# EAGLE design sensorboard_18_DS2_dD2b (EAGLE 9.6.0)
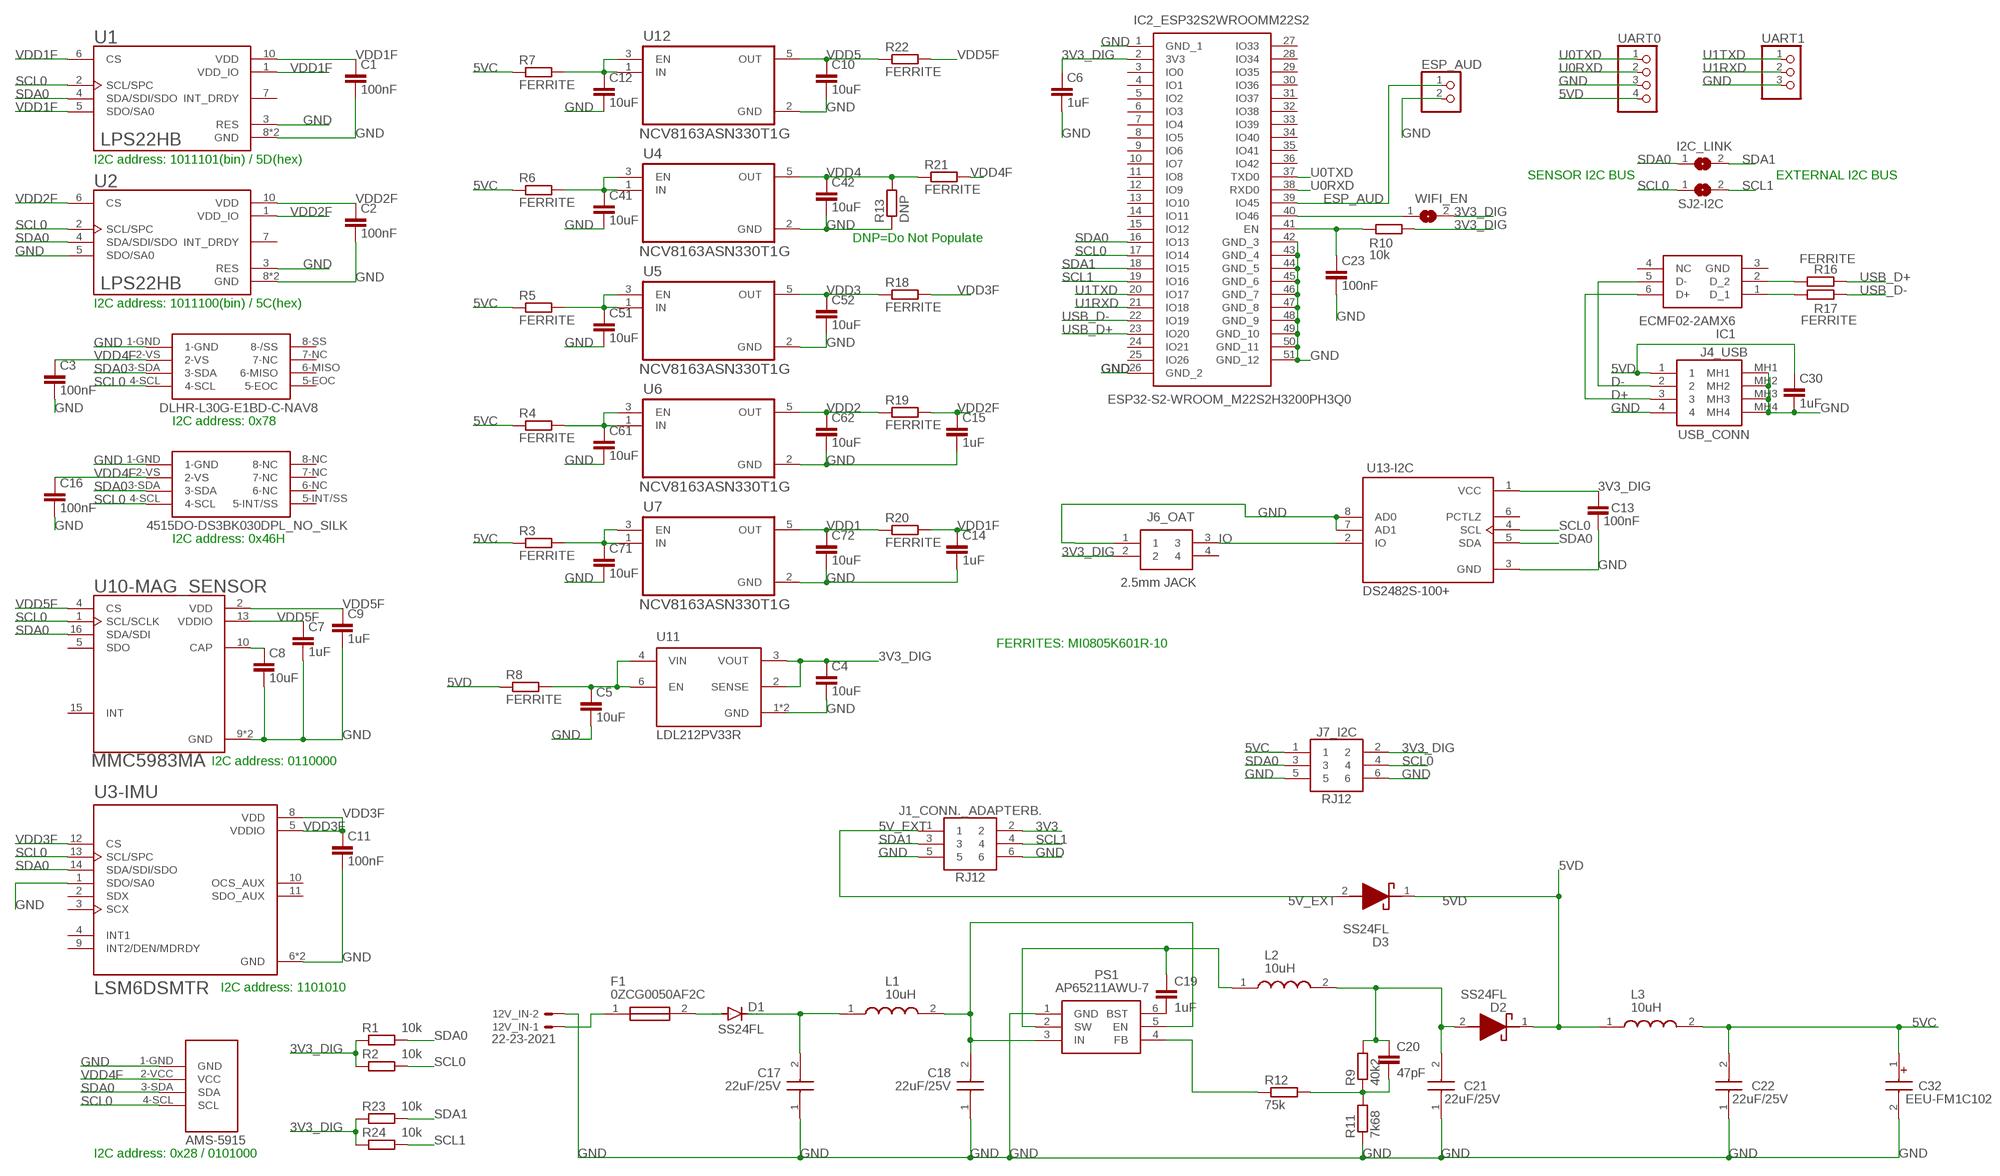
[diagram p0: schematic, sheet 1]

## Parts
12V_IN  22-23-2021  [22-23-2021]
C1  100nF  C-EUC0603  [C0603]
C2  100nF  C-EUC0603  [C0603]
C3  100nF  C-EUC0805  [C0805]
C4  10uF  C-EUC0805  [C0805]
C5  10uF  C-EUC0805  [C0805]
C6  1uF  C-EUC0805  [C0805]
C7  1uF  C-EUC0805  [C0805]
C8  10uF  C-EUC0805  [C0805]
C9  1uF  C-EUC0805  [C0805]
C10  10uF  C-EUC0805  [C0805]
C11  100nF  C-EUC0805  [C0805]
C12  10uF  C-EUC0805  [C0805]
C13  100nF  C-EUC0805  [C0805]
C14  1uF  C-EUC0805  [C0805]
C15  1uF  C-EUC0805  [C0805]
C16  100nF  C-EUC0805  [C0805]
C17  22uF/25V  CL31A226KAHNNNE  [CAPC3216X180N]
C18  22uF/25V  CL31A226KAHNNNE  [CAPC3216X180N]
C19  1uF  C-EUC0805  [C0805]
C20  47pF  C-EUC0805  [C0805]
C21  22uF/25V  CL31A226KAHNNNE  [CAPC3216X180N]
C22  22uF/25V  CL31A226KAHNNNE  [CAPC3216X180N]
C23  100nF  C-EUC0805  [C0805]
C30  1uF  C-EUC0805  [C0805]
C32  EEU-FM1C102  [CAPPRD500W65D1000H2200]
C41  10uF  C-EUC0805  [C0805]
C42  10uF  C-EUC0805  [C0805]
C51  10uF  C-EUC0805  [C0805]
C52  10uF  C-EUC0805  [C0805]
C61  10uF  C-EUC0805  [C0805]
C62  10uF  C-EUC0805  [C0805]
C71  10uF  C-EUC0805  [C0805]
C72  10uF  C-EUC0805  [C0805]
D1  SS24FL  DIODE-DO-214AC  [DO-214AC]
D2  SS24FL  [SODFL3617X108N]
D3  SS24FL  [SODFL3617X108N]
ESP_AUD  PINHD-1X2  [1X02]
F1  0ZCG0050AF2C  [FUSC4632X75N]
I2C_LINK  SJ  [SJ]
IC1  ECMF02-2AMX6  [SON50P150X170X55-6N]
IC2_ESP32S2WROOMM22S2  ESP32-S2-WROOM_M22S2H3200PH3Q0  [ESP32S2WROOMM22S2H3200PH3Q0]
J1_CONN._ADAPTERB.  RJ12  SAMACSYS_615006138421"  [SAMACSYS_615006138421_MOD]
J4_USB  USB_CONN  73725-0110BLF  [737250110BLF]
J6_OAT  2.5mm JACK  SJ-2523-SMT-TR  [SJ-2523-SMT-TR]
J7_I2C  RJ12  SAMACSYS_615006138421"  [SAMACSYS_615006138421_MOD]
L1  10uH  FDSD0420-H-100M=P3  [FDSD0420WH150MP3]
L2  10uH  FDSD0420-H-100M=P3  [FDSD0420WH150MP3]
L3  10uH  FDSD0420-H-100M=P3  [FDSD0420WH150MP3]
PS1  AP65211AWU-7  [SOT95P280X90-6N]
R1  10k  R-EU_R0805  [R0805]
R2  10k  R-EU_R0805  [R0805]
R3  FERRITE  R-EU_R0805  [R0805]
R4  FERRITE  R-EU_R0805  [R0805]
R5  FERRITE  R-EU_R0805  [R0805]
R6  FERRITE  R-EU_R0805  [R0805]
R7  FERRITE  R-EU_R0805  [R0805]
R8  FERRITE  R-EU_R0805  [R0805]
R9  40k2  R-EU_R0805  [R0805]
R10  10k  R-EU_R0805  [R0805]
R11  7k68  R-EU_R0805  [R0805]
R12  75k  R-EU_R0805  [R0805]
R13  DNP  R-EU_R0805  [R0805]
R16  FERRITE  R-EU_R0805  [R0805]
R17  FERRITE  R-EU_R0805  [R0805]
R18  FERRITE  R-EU_R0805  [R0805]
R19  FERRITE  R-EU_R0805  [R0805]
R20  FERRITE  R-EU_R0805  [R0805]
R21  FERRITE  R-EU_R0805  [R0805]
R22  FERRITE  R-EU_R0805  [R0805]
R23  10k  R-EU_R0805  [R0805]
R24  10k  R-EU_R0805  [R0805]
SJ2-I2C  SJ  [SJ]
U1  LPS22HB  [LGA10R50P2X3_200X200X80]
U2  LPS22HB  [LGA10R50P2X3_200X200X80]
U3-IMU  LSM6DSMTR  [PQFN50P300X250X86-14N]
U4  NCV8163ASN330T1G  [SOP95P275X110-5N]
U5  NCV8163ASN330T1G  [SOP95P275X110-5N]
U6  NCV8163ASN330T1G  [SOP95P275X110-5N]
U7  NCV8163ASN330T1G  [SOP95P275X110-5N]
U10-MAG_SENSOR  MMC5983MA  [LGA16R50P4X4_330X330X100]
U11  LDL212PV33R  [SON50P200X200X80-7N]
U12  NCV8163ASN330T1G  [SOP95P275X110-5N]
U13-I2C  DS2482S-100+  [SOIC127P600X175-8N]
U$1  AMS-5915  [AMS-5915]
U$3  DLHR-L30G-E1BD-C-NAV8  [DLHR-L30G-E1BD-C-NAV8]
U$4  4515DO-DS3BK030DPL  4515DO-DS3BK030DPL_NO_SILKNO_SILK  [4515DO-DS3BK030DPL_NO_SILK]
UART0  PINHD-1X4  [1X04]
UART1  PINHD-1X3  [1X03]
WIFI_EN  SJ  [SJ]

## Nets
3V3: J1_CONN._ADAPTERB..2
3V3_DIG: C4.1 C6.1 C13.1 IC2_ESP32S2WROOMM22S2.2(3V3) J6_OAT.2 J7_I2C.2 R1.1 R2.1 R10.2 R23.1 R24.1 U11.2(SENSE) U11.3(VOUT) U13-I2C.1(VCC) WIFI_EN.2
5V_EXT: D3.2(A) J1_CONN._ADAPTERB..1
5VC: C22.2 C32.1(+) J7_I2C.1 L3.2 R3.1 R4.1 R5.1 R6.1 R7.1
5VD: C30.1 D2.1(K) D3.1(K) J4_USB.1 L3.1 R8.1 UART0.4
D+: IC1.6(D+) J4_USB.3
D-: IC1.5(D-) J4_USB.2
ESP_AUD: ESP_AUD.1 IC2_ESP32S2WROOMM22S2.39(IO45)
GND: 12V_IN.2 C1.2 C2.2 C3.2 C4.2 C5.2 C6.2 C7.2 C8.2 C9.2 C10.2 C11.2 C12.2 C13.2 C14.2 C15.2 C16.2 C17.1 C18.1 C21.1 C22.1 C23.2 C30.2 C32.2(-) C41.2 C42.2 C51.2 C52.2 C61.2 C62.2 C71.2 C72.2 ESP_AUD.2 IC2_ESP32S2WROOMM22S2.1(GND_1) IC2_ESP32S2WROOMM22S2.26(GND_2) IC2_ESP32S2WROOMM22S2.42(GND_3) IC2_ESP32S2WROOMM22S2.43(GND_4) IC2_ESP32S2WROOMM22S2.44(GND_5) IC2_ESP32S2WROOMM22S2.45(GND_6) IC2_ESP32S2WROOMM22S2.46(GND_7) IC2_ESP32S2WROOMM22S2.47(GND_8) IC2_ESP32S2WROOMM22S2.48(GND_9) IC2_ESP32S2WROOMM22S2.49(GND_10) IC2_ESP32S2WROOMM22S2.50(GND_11) IC2_ESP32S2WROOMM22S2.51(GND_12) J1_CONN._ADAPTERB..5 J1_CONN._ADAPTERB..6 J4_USB.4 J4_USB.MH1 J4_USB.MH2 J4_USB.MH3 J4_USB.MH4 J6_OAT.1 J7_I2C.5 J7_I2C.6 PS1.1(GND) R11.1 R13.1 U1.3(RES) U1.8(GND) U1.9(GND) U2.3(RES) U2.5(SDO/SA0) U2.8(GND) U2.9(GND) U3-IMU.1(SDO/SA0) U3-IMU.6(GND) U3-IMU.7(GND) U4.2(GND) U5.2(GND) U6.2(GND) U7.2(GND) U10-MAG_SENSOR.9(GND) U10-MAG_SENSOR.11(GND) U11.1(GND) U11.7(GND) U12.2(GND) U13-I2C.3(GND) U13-I2C.7(AD1) U13-I2C.8(AD0) U$1.1-GND(GND) U$3.1-GND U$4.1-GND UART0.3 UART1.3
IO: J6_OAT.3 U13-I2C.2(IO)
N$2: C8.1 U10-MAG_SENSOR.10(CAP)
N$7: C23.1 IC2_ESP32S2WROOMM22S2.41(EN) R10.1
N$9: C17.2 D1.C L1.1
N$13: C18.2 L1.2 PS1.3(IN) PS1.5(EN)
N$16: C20.2 R9.1 R11.2 R12.2
N$17: C19.1 L2.1 PS1.2(SW)
N$18: PS1.4(FB) R12.1
N$20: C19.2 PS1.6(BST)
N$24: 12V_IN.1 F1.1
N$25: IC2_ESP32S2WROOMM22S2.40(IO46) WIFI_EN.1
N$27: IC1.1(D_1) R17.1
N$28: IC1.2(D_2) R16.1
N$32: D1.A F1.2
N$33: C20.1 C21.2 D2.2(A) L2.2 R9.2
SCL0: IC2_ESP32S2WROOMM22S2.17(IO14) J7_I2C.4 R2.2 SJ2-I2C.1 U1.2(SCL/SPC) U2.2(SCL/SPC) U3-IMU.13(SCL/SPC) U10-MAG_SENSOR.1(SCL/SCLK) U13-I2C.4(SCL) U$1.4-SCL(SCL) U$3.4-SCL U$4.4-SCL
SCL1: IC2_ESP32S2WROOMM22S2.19(IO16) J1_CONN._ADAPTERB..4 R24.2 SJ2-I2C.2
SDA0: I2C_LINK.1 IC2_ESP32S2WROOMM22S2.16(IO13) J7_I2C.3 R1.2 U1.4(SDA/SDI/SDO) U2.4(SDA/SDI/SDO) U3-IMU.14(SDA/SDI/SDO) U10-MAG_SENSOR.16(SDA/SDI) U13-I2C.5(SDA) U$1.3-SDA(SDA) U$3.3-SDA U$4.3-SDA
SDA1: I2C_LINK.2 IC2_ESP32S2WROOMM22S2.18(IO15) J1_CONN._ADAPTERB..3 R23.2
U0RXD: IC2_ESP32S2WROOMM22S2.38(RXD0) UART0.2
U0TXD: IC2_ESP32S2WROOMM22S2.37(TXD0) UART0.1
U1RXD: IC2_ESP32S2WROOMM22S2.21(IO18) UART1.2
U1TXD: IC2_ESP32S2WROOMM22S2.20(IO17) UART1.1
USB_D+: IC2_ESP32S2WROOMM22S2.23(IO20) R16.2
USB_D-: IC2_ESP32S2WROOMM22S2.22(IO19) R17.2
VDD1: C72.1 R20.1 U7.5(OUT)
VDD1F: C1.1 C14.1 R20.2 U1.1(VDD_IO) U1.5(SDO/SA0) U1.6(CS) U1.10(VDD)
VDD1P: C71.1 R3.2 U7.1(IN) U7.3(EN)
VDD2: C62.1 R19.1 U6.5(OUT)
VDD2F: C2.1 C15.1 R19.2 U2.1(VDD_IO) U2.6(CS) U2.10(VDD)
VDD2P: C61.1 R4.2 U6.1(IN) U6.3(EN)
VDD3: C52.1 R18.1 U5.5(OUT)
VDD3F: C11.1 R18.2 U3-IMU.5(VDDIO) U3-IMU.8(VDD) U3-IMU.12(CS)
VDD3P: C51.1 R5.2 U5.1(IN) U5.3(EN)
VDD4: C42.1 R13.2 R21.1 U4.5(OUT)
VDD4F: C3.1 C16.1 R21.2 U$1.2-VCC(VCC) U$3.2-VS U$4.2-VS
VDD4P: C41.1 R6.2 U4.1(IN) U4.3(EN)
VDD5: C10.1 R22.1 U12.5(OUT)
VDD5F: C7.1 C9.1 R22.2 U10-MAG_SENSOR.2(VDD) U10-MAG_SENSOR.4(CS) U10-MAG_SENSOR.13(VDDIO)
VDD5P: C12.1 R7.2 U12.1(IN) U12.3(EN)
VDD_DIGP: C5.1 R8.2 U11.4(VIN) U11.6(EN)
Unconnected: IC1.4(NC) IC2_ESP32S2WROOMM22S2.3(IO0) IC2_ESP32S2WROOMM22S2.4(IO1) IC2_ESP32S2WROOMM22S2.5(IO2) IC2_ESP32S2WROOMM22S2.6(IO3) IC2_ESP32S2WROOMM22S2.7(IO4) IC2_ESP32S2WROOMM22S2.8(IO5) IC2_ESP32S2WROOMM22S2.9(IO6) IC2_ESP32S2WROOMM22S2.10(IO7) IC2_ESP32S2WROOMM22S2.11(IO8) IC2_ESP32S2WROOMM22S2.12(IO9) IC2_ESP32S2WROOMM22S2.13(IO10) IC2_ESP32S2WROOMM22S2.14(IO11) IC2_ESP32S2WROOMM22S2.15(IO12) IC2_ESP32S2WROOMM22S2.24(IO21) IC2_ESP32S2WROOMM22S2.25(IO26) IC2_ESP32S2WROOMM22S2.27(IO33) IC2_ESP32S2WROOMM22S2.28(IO34) IC2_ESP32S2WROOMM22S2.29(IO35) IC2_ESP32S2WROOMM22S2.30(IO36) IC2_ESP32S2WROOMM22S2.31(IO37) IC2_ESP32S2WROOMM22S2.32(IO38) IC2_ESP32S2WROOMM22S2.33(IO39) IC2_ESP32S2WROOMM22S2.34(IO40) IC2_ESP32S2WROOMM22S2.35(IO41) IC2_ESP32S2WROOMM22S2.36(IO42) J6_OAT.4 U1.7(INT_DRDY) U2.7(INT_DRDY) U3-IMU.2(SDX) U3-IMU.3(SCX) U3-IMU.4(INT1) U3-IMU.9(INT2/DEN/MDRDY) U3-IMU.10(OCS_AUX) U3-IMU.11(SDO_AUX) U10-MAG_SENSOR.5(SDO) U10-MAG_SENSOR.15(INT) U13-I2C.6(PCTLZ) U$3.5-EOC U$3.6-MISO U$3.7-NC U$3.8-SS(8-/SS) U$4.5-INT/SS U$4.6-NC U$4.7-NC U$4.8-NC

## Notes on the sheet
- I2C address: 1011101(bin) / 5D(hex)
- SENSOR I2C BUS | EXTERNAL I2C BUS
- DNP=Do Not Populate
- I2C address: 1011100(bin) / 5C(hex)
- I2C address: 0x78
- I2C address: 0x46H
- FERRITES: MI0805K601R-10
- I2C address: 0110000
- I2C address: 1101010
- I2C address: 0x28 / 0101000

## Power pins joined to a net without a drawn wire
GND: IC1.3(GND)

## Library data of the parts
12V_IN = con-molex:22-23-2021: .100" (2.54mm) Center Header - 2 Pin; MF: MOLEX; MPN: 22-23-2021; OC_FARNELL: 1462926; OC_NEWARK: 25C3832
C1-C16 C19 C20 C23 C30 C41 C42 C51 C52 C61 C62 C71 C72 = rcl:C-EU: CAPACITOR, European symbol; SPICEPREFIX: C
C17 C18 C21 C22 = SamacSys_Parts:CL31A226KAHNNNE: SAMSUNG ELECTRO-MECHANICS - CL31A226KAHNNNE - CAP, 22UF, 25V, MLCC, 1206 Source: Datasheet <http://www.samsungsem.com/kr/support/product-search/mlcc/CL31A226KAHNNNE.jsp>; DESCRIPTION: SAMSUNG ELECTRO-MECHANICS - CL31A226KAHNNNE - CAP, 22UF, 25V, MLCC, 1206; HEIGHT: 1.8mm; MANUFACTURER_NAME: Samsung Electro-Mechanics; MANUFACTURER_PART_NUMBER: CL31A226KAHNNNE; MOUSER_PART_NUMBER: N/A; MOUSER_PRICE-STOCK: https://www.mouser.com/Search/Refine.aspx?Keyword=N%2FA
C32 = SamacSys_Parts:EEU-FM1C102: Al Electrolytic Cap 105C 16V 1000uF Panasonic 1000uF 16 V dc Aluminium Electrolytic Capacitor, FM Series 5000h 10 Dia. x 20mm Source: Datasheet <http://industrial.panasonic.com/cdbs/www-data/pdf/RDF0000/ABA0000C1018.pdf>; DESCRIPTION: Al Electrolytic Cap 105C 16V 1000uF Panasonic 1000uF 16 V dc Aluminium Electrolytic Capacitor, FM Series 5000h 10 Dia. x 20mm; HEIGHT: 22mm; MANUFACTURER_NAME: Panasonic; MANUFACTURER_PART_NUMBER: EEU-FM1C102; MOUSER_PART_NUMBER: 667-EEU-FM1C102; MOUSER_PRICE-STOCK: https://www.mouser.co.uk/ProductDetail/Panasonic/EEU-FM1C102?qs=MtOUKumLmnZ3b%252BuCdcXLJA%3D%3D
D1 = diode:DIODE-: DIODE
D2 D3 = SamacSys_Parts:SS24FL: ON SEMICONDUCTOR - SS24FL - SCHOTTKY RECT, AEC-Q101, 40V, SOD-123F Source: Datasheet <https://www.onsemi.com/pub/Collateral/SS26FL-D.PDF>; DESCRIPTION: ON SEMICONDUCTOR - SS24FL - SCHOTTKY RECT, AEC-Q101, 40V, SOD-123F; HEIGHT: 1.08mm; MANUFACTURER_NAME: ON Semiconductor; MANUFACTURER_PART_NUMBER: SS24FL; MOUSER_PART_NUMBER: 512-SS24FL; MOUSER_PRICE-STOCK: https://www.mouser.co.uk/ProductDetail/ON-Semiconductor-Fairchild/SS24FL?qs=tqW9UTzndZyvT5hdH%252BfSxg%3D%3D
ESP_AUD = pinhead:PINHD-1X2: PIN HEADER
F1 = SamacSys_Parts:0ZCG0050AF2C: Resettable Fuses - PPTC Fuse Source: Datasheet <http://belfuse.com/pdfs/0ZCG.pdf>; DESCRIPTION: Resettable Fuses - PPTC Fuse; HEIGHT: 0.75mm; MANUFACTURER_NAME: Stewart Connector; MANUFACTURER_PART_NUMBER: 0ZCG0050AF2C; MOUSER_PART_NUMBER: 530-0ZCG0050AF2C; MOUSER_PRICE-STOCK: https://www.mouser.co.uk/ProductDetail/Bel-Fuse/0ZCG0050AF2C?qs=SRYZG9HaIQ0mNZjboPT99Q%3D%3D
I2C_LINK SJ2-I2C WIFI_EN = jumper:SJ: SMD solder JUMPER
IC1 = ECMF02-2AMX6:ECMF02-2AMX6: Common Mode Filter & ESD Prot. USB uQFN6 STMicroelectronics ECMF02 Series, Signal Filter, 200mA uQFN SMD, Flat Contact Termination, 1.8 x 1.6 x 0.5mm Source: Datasheet <http://www.st.com/content/ccc/resource/technical/document/datasheet/3a/28/cf/d0/31/63/48/8c/CD00282307.pdf/files/CD00282307.pdf/jcr:content/translations/en.CD00282307.pdf> Check prices <https://pricing.snapeda.com/parts/ECMF02-2AMX6/STMicroelectronics/view-part?ref=eda>; AVAILABILITY: Good; DESCRIPTION: 2 Line Common Mode Choke Surface Mount 200mA DCR 2.5Ohm; MF: STMicroelectronics; MP: ECMF02-2AMX6; PACKAGE: UFQFN-6 STMicroelectronics; PRICE: None; PURCHASE-URL: https://pricing.snapeda.com/search/part/ECMF02-2AMX6/?ref=eda
IC2_ESP32S2WROOMM22S2 = SamacSys_Parts:ESP32-S2-WROOM_M22S2H3200PH3Q0: WiFi Modules (802.11) Module ESP32-S2 WROOM PCB ANT Source: Datasheet; DESCRIPTION: WiFi Modules (802.11) Module ESP32-S2 WROOM PCB ANT; HEIGHT: 3.45mm; MANUFACTURER_NAME: Espressif Systems; MANUFACTURER_PART_NUMBER: ESP32-S2-WROOM(M22S2H3200PH3Q0); MOUSER_PART_NUMBER: 356-ESP32S2WRM3200PH; MOUSER_PRICE-STOCK: https://www.mouser.co.uk/ProductDetail/Espressif-Systems/ESP32-S2-WROOMM22S2H3200PH3Q0?qs=vHuUswq2%252BsxRlbezmiT%252B3g%3D%3D
J1_CONN._ADAPTERB. J7_I2C = Sensor_Board_DS2:SAMACSYS_615006138421: HORIZONTAL PLASTIC 6P6C MODULAR JACK TAP UP Source: Datasheet <http://docs-emea.rs-online.com/webdocs/0f88/0900766b80f88670.pdf>
J4_USB = SamacSys_Parts:73725-0110BLF: USB Connectors USB UP RIGHT RECEP W/O SENSOR FLAG Source: Datasheet; DESCRIPTION: USB Connectors USB UP RIGHT RECEP W/O SENSOR FLAG; HEIGHT: 14.03mm; MANUFACTURER_NAME: Amphenol; MANUFACTURER_PART_NUMBER: 73725-0110BLF; MOUSER_PART_NUMBER: 649-73725-0110BLF; MOUSER_PRICE-STOCK: https://www.mouser.co.uk/ProductDetail/Amphenol-FCI/73725-0110BLF?qs=x6EjVpvqMVP%252BaDTVID3rTA%3D%3D
J6_OAT = SamacSys_Parts:SJ-2523-SMT-TR: 2.5 MM AUDIO JACK Source: Datasheet <http://www.cui.com/product/resource/digikeypdf/sj-252x-smt_series.pdf>; ARROW_PART_NUMBER: SJ-2523-SMT-TR; ARROW_PRICE-STOCK: https://www.arrow.com/en/products/sj-2523-smt-tr/cui-devices; DESCRIPTION: 2.5 MM AUDIO JACK; HEIGHT: mm; MANUFACTURER_NAME: CUI Inc.; MANUFACTURER_PART_NUMBER: SJ-2523-SMT-TR; MOUSER_PART_NUMBER: 490-SJ-2523-SMT-TR; MOUSER_PRICE-STOCK: https://www.mouser.co.uk/ProductDetail/CUI-Devices/SJ-2523-SMT-TR/?qs=WyjlAZoYn50TRxpi%2FhdHvw%3D%3D
L1-L3 = SamacSys_Parts:FDSD0420-H-100M=P3: Toko FDSD0420 Series Shielded Wire-wound SMD Inductor with a Powered Iron Core, 10 uH Wire-Wound 3.3A Idc Source: Datasheet <https://psearch.en.murata.com/inductor/product/FDSD0420-H-100M#.html>; DESCRIPTION: Toko FDSD0420 Series Shielded Wire-wound SMD Inductor with a Powered Iron Core, 10 uH Wire-Wound 3.3A Idc; HEIGHT: 2mm; MANUFACTURER_NAME: Murata Electronics; MANUFACTURER_PART_NUMBER: FDSD0420-H-100M=P3; MOUSER_PART_NUMBER: 81-FDSD0420-H-100MP3; MOUSER_PRICE-STOCK: https://www.mouser.co.uk/ProductDetail/Murata-Electronics/FDSD0420-H-100M%3dP3?qs=KuGPmAKtFKXZ0m3Q9jeEIg%3D%3D
PS1 = SamacSys_Parts:AP65211AWU-7: Switching Voltage Regulators DCDC Conv HV Buck Source: Datasheet <https://componentsearchengine.com/Datasheets/1/AP65211AWU-7.pdf>; DESCRIPTION: Switching Voltage Regulators DCDC Conv HV Buck; HEIGHT: 0.9mm; MANUFACTURER_NAME: Diodes Inc.; MANUFACTURER_PART_NUMBER: AP65211AWU-7; MOUSER_PART_NUMBER: 621-AP65211AWU-7; MOUSER_PRICE-STOCK: https://www.mouser.co.uk/ProductDetail/Diodes-Incorporated/AP65211AWU-7?qs=HXFqYaX1Q2yDqQLsq3DZAg%3D%3D
R1-R13 R16-R24 = rcl:R-EU_: RESISTOR, European symbol; SPICEPREFIX: R
U1 U2 = LPS22HB:LPS22HB: MEMS nano pressure sensor: 260-1260 hPa absolute digital output barometer; AVAILABILITY: Unavailable; DESCRIPTION: Pressure Sensor 3.77PSI ~ 18.27PSI (26kPa ~ 126kPa) Absolute 24 b 10-WFLGA Exposed Pad; MF: STMicroelectronics; MP: LPS22HB; PACKAGE: WFLGA-10 STMicroelectronics; PRICE: None
U3-IMU = LSM6DSMTR:LSM6DSMTR: iNEMO inertial module: 3D accelerometer and 3D gyroscope Check prices <https://snapeda.com/parts/LSM6DSMTR/STMicroelectronics/view-part/?ref=eda>; ARROW_ELECTRONICS-PURCHASE-URL: https://snapeda.com/shop?store=Arrow+Electronics&id=581716; AVAILABILITY: Good; DESCRIPTION: Accelerometer, Gyroscope, Temperature, 6 Axis Sensor I²C, SPI Output; DIGIKEY-PURCHASE-URL: https://snapeda.com/shop?store=DigiKey&id=581716; MF: STMicroelectronics; MOUSER-PURCHASE-URL: https://snapeda.com/shop?store=Mouser&id=581716; MP: LSM6DSMTR; PACKAGE: VFLGA-14 STMicroelectronics; PRICE: None
U4-U7 U12 = NCV8163ASN330T1G:NCV8163ASN330T1G: None Check prices <https://snapeda.com/parts/NCV8163ASN330T1G/ON%20Semiconductor/view-part/?ref=eda>; AVAILABILITY: Warning; DESCRIPTION: Linear Voltage Regulator IC 1 Output 250mA 5-TSOP; MF: ON Semiconductor; MOUSER-PURCHASE-URL: https://snapeda.com/shop?store=Mouser&id=3218317; MP: NCV8163ASN330T1G; PACKAGE: TSOP-5 ON Semiconductor; PRICE: None
U10-MAG_SENSOR = FIS1100:MMC5983MA: MMC5983MA Magnetometer; ARROW_ELECTRONICS-PURCHASE-URL: https://snapeda.com/shop?store=Arrow+Electronics&id=1392125; AVAILABILITY: Good; DESCRIPTION: Accelerometer, Gyroscope, 6 Axis Sensor I²C Output; DIGIKEY-PURCHASE-URL: https://snapeda.com/shop?store=DigiKey&id=1392125; MF: ON Semiconductor; MP: FIS1100; PACKAGE: VFLGA-16 ON Semiconductor; PRICE: None
U11 = LDL212PV33R:LDL212PV33R: Linear Voltage Regulator IC 1 Output 1.2A 6-DFN (2x2) Check prices <https://snapeda.com/parts/LDL212PV33R/STMicroelectronics/view-part/?ref=eda>; ARROW_ELECTRONICS-PURCHASE-URL: https://snapeda.com/shop?store=Arrow+Electronics&id=4551149; AVAILABILITY: Good; DESCRIPTION: Linear Voltage Regulator IC 1 Output 1.2A 6-DFN (2x2); DIGIKEY-PURCHASE-URL: https://snapeda.com/shop?store=DigiKey&id=4551149; MF: STMicroelectronics; MOUSER-PURCHASE-URL: https://snapeda.com/shop?store=Mouser&id=4551149; MP: LDL212PV33R; PACKAGE: DFN-6 STMicroelectronics; PRICE: None
U13-I2C = DS2482S-100_:DS2482S-100+: DS2460S Series 5.5 V 400 kHz I2C Surface Mount Smart Card Interface IC - SOIC-8 Check prices <https://snapeda.com/parts/DS2482S-100%2B/Maxim%20Integrated/view-part/?ref=eda>; AVAILABILITY: Warning; DESCRIPTION: 1-Wire® Bridge, 1-Wire® to I²C I²C Interface 8-SOIC; DIGIKEY-PURCHASE-URL: https://snapeda.com/shop?store=DigiKey&id=587620; MF: Maxim Integrated; MOUSER-PURCHASE-URL: https://snapeda.com/shop?store=Mouser&id=587620; MP: DS2482S-100+; PACKAGE: SOIC-8 Maxim; PRICE: None
U$1 = pressure_01:AMS-5915
U$3 = pressure_01:DLHR-L30G-E1BD-C-NAV8; DLHR-L30G-E1BD-C-NAV8: DLHR-L30G-E1BD-C-NAV8
U$4 = pressure_01:4515DO-DS3BK030DPL_NO_SILK
UART0 = pinhead:PINHD-1X4: PIN HEADER
UART1 = pinhead:PINHD-1X3: PIN HEADER

## Net classes
0 default: clearance 0.205 mm

## Board
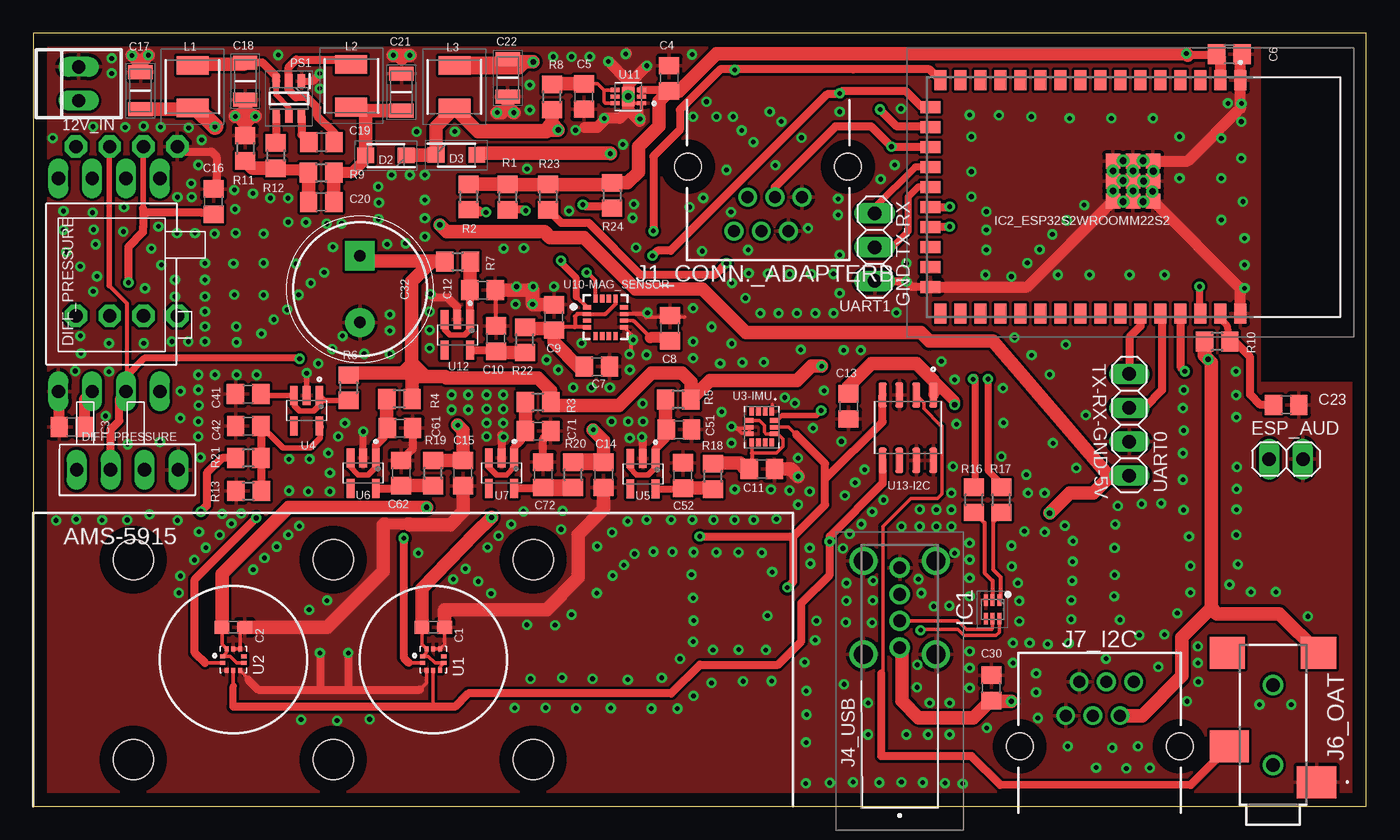
[diagram p1: board, top side]
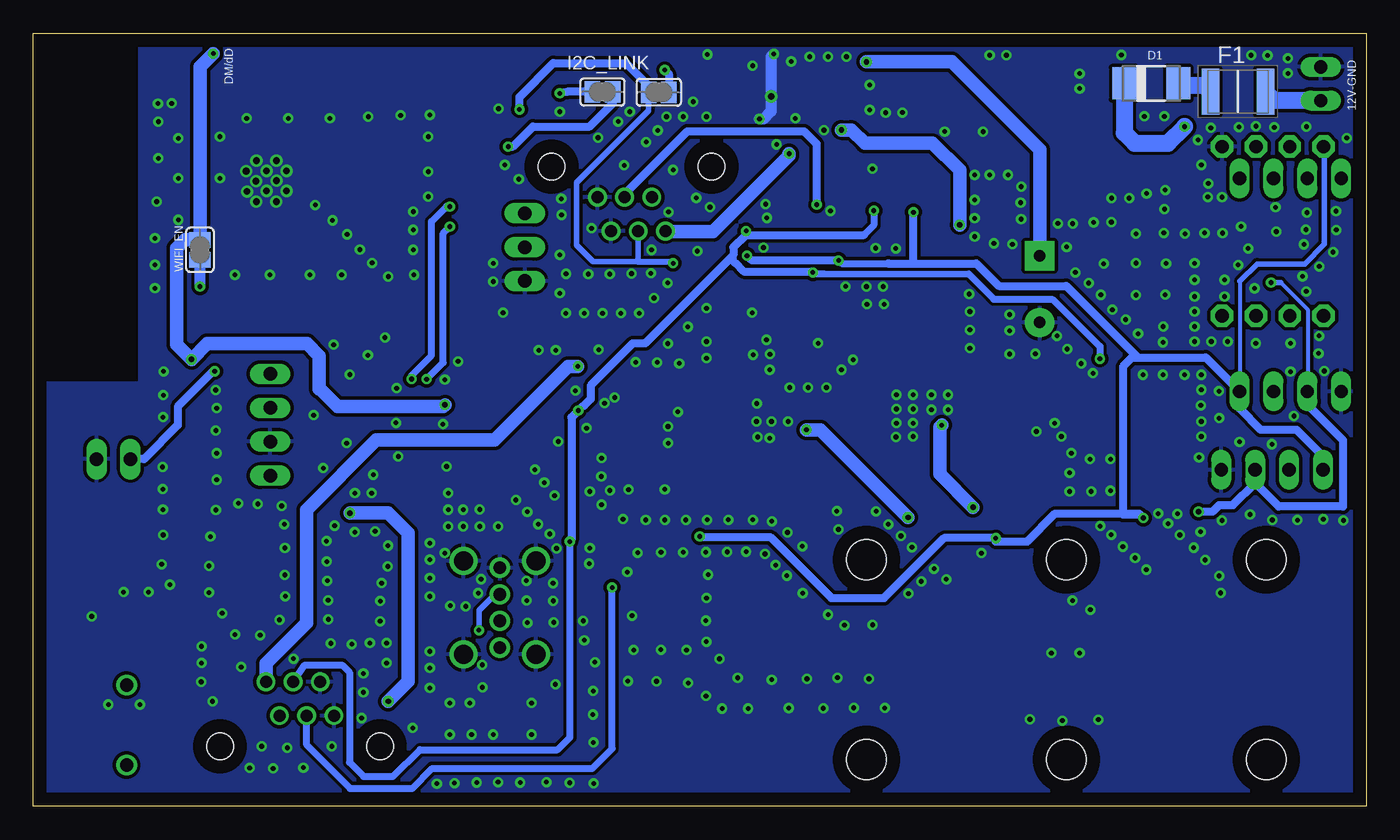
[diagram p2: board, bottom side, seen from below]

Size 100 x 58 mm. Coordinates in mm from the lower left corner, seen from the top.
Outline: 0,0 100,0 100,58 0,58 0,0
Copper layers (1*16): Top 0.035mm / dielectric 1.5mm / Bottom 0.035mm
Design rules "default *": minimum track width 6mil, minimum drill 0.35mm, track to track 6mil, track to pad 6mil, pad to pad 6mil, via to via 6mil, smd to smd 6mil, copper to edge 40mil, drill to drill 6mil, minimum pad ring 10mil, minimum via ring 8mil, stop-mask expansion 4mil, vias tented up to drill 14mil, thermal gap 10mil

### Footprints (pad centres in the part's own frame; a part is rotated, then mirrored left to right if it is on the bottom)
22-23-2021 = drill 1 long: 1 -1.27,0; 2 1.27,0
C0603 = smd 1.1 x 1: 1 -0.85,0; 2 0.85,0
C0805 = smd 1.3 x 1.5: 1 -0.95,0; 2 0.95,0
CAPC3216X180N = smd 1.05 x 1.82: 1 -1.39,0; 2 1.39,0
CAPPRD500W65D1000H2200 = drill 0.85 pad 2.184 square: 1 0,0 | drill 0.85 pad 2.184: 2 5,0
DO-214AC = smd 1.8 x 2.4: A 2.025,0; C -2.025,0
SODFL3617X108N = smd 1.26 x 1.17: 1 -1.525,0; 2 1.525,0
1X02 = drill 1.016 long: 1 -1.27,0; 2 1.27,0
FUSC4632X75N = smd 1.32 x 3.43: 1 -2.06,0; 2 2.06,0
SJ = smd 1.168 x 1.6: 1 -0.762,0; 2 0.762,0
SON50P150X170X55-6N = smd 0.85 x 0.3: 1 -0.7,0.5; 2 -0.7,0; 3 -0.7,-0.5; 4 0.7,-0.5; 5 0.7,0; 6 0.7,0.5
ESP32S2WROOMM22S2H3200PH3Q0 = smd 1.5 x 0.9: 1 -8.75,8; 2 -8.75,6.5; 3 -8.75,5; 4 -8.75,3.5; 5 -8.75,2; 6 -8.75,0.5; 7 -8.75,-1; 8 -8.75,-2.5; 9 -8.75,-4; 10 -8.75,-5.5; 11 -8.75,-7; 12 -8.75,-8.5; 13 -8.75,-10; 14 -8.75,-11.5; 15 -8.75,-13; 16 -8.75,-14.5; 27 8.75,-14.5; 28 8.75,-13; 29 8.75,-11.5; 30 8.75,-10; 31 8.75,-8.5; 32 8.75,-7; 33 8.75,-5.5; 34 8.75,-4; 35 8.75,-2.5; 36 8.75,-1; 37 8.75,0.5; 38 8.75,2; 39 8.75,3.5; 40 8.75,5; 41 8.75,6.5; 42 8.75,8 | smd 0.9 x 1.5: 17 -6.75,-15.25; 18 -5.25,-15.25; 19 -3.75,-15.25; 20 -2.25,-15.25; 21 -0.75,-15.25; 22 0.75,-15.25; 23 2.25,-15.25; 24 3.75,-15.25; 25 5.25,-15.25; 26 6.75,-15.25 | smd 1.1 x 1.1: 43 -1.19,-0.05; 44 -2.69,-0.05; 45 -2.69,-1.55; 46 -1.19,-1.55; 47 0.31,-1.55; 48 0.31,-0.05; 49 0.31,1.45; 50 -1.19,1.45; 51 -2.69,1.45
SAMACSYS_615006138421_MOD = drill 0.9 pad 1.4: 1 2.55,4.84; 2 1.53,2.3; 3 0.51,4.84; 4 -0.51,2.3; 5 -1.53,4.84; 6 -2.55,2.3 | hole 2: 6,0; -6,0
737250110BLF = drill 0.97 pad 1.509: 1 0,0; 2 0,2; 3 0,4; 4 0,6 | drill 1.4 pad 2.1: MH1 -2.72,6.5; MH2 2.72,6.5; MH3 2.72,-0.5; MH4 -2.72,-0.5
SJ-2523-SMT-TR = smd 2.4 x 2.95: 1 1.7,-3.275; 3 4.4,3.275 | smd 2.4 x 2.65: 2 11.4,-3.425; 4 11.4,3.425 | drill 1 pad 1.55: 5 3,0; 6 9,0
FDSD0420WH150MP3 = smd 1.4 x 2.4: 1 -1.6,0; 2 1.6,0
SOT95P280X90-6N = smd 1.05 x 0.55: 1 -1.3,0.95; 2 -1.3,0; 3 -1.3,-0.95; 4 1.3,-0.95; 5 1.3,0; 6 1.3,0.95
R0805 = smd 1.3 x 1.5: 1 -0.95,0; 2 0.95,0
LGA10R50P2X3_200X200X80 = smd 0.4 x 0.3: 1 -0.8,0.25; 2 -0.8,-0.25; 6 0.8,-0.25; 7 0.8,0.25 | smd 0.3 x 0.4: 3 -0.5,-0.8; 4 0,-0.8; 5 0.5,-0.8; 8 0.5,0.8; 9 0,0.8; 10 -0.5,0.8
PQFN50P300X250X86-14N = smd 0.6 x 0.35: 1 -1.16,0.75; 2 -1.16,0.25; 3 -1.16,-0.25; 4 -1.16,-0.75; 8 1.16,-0.75; 9 1.16,-0.25; 10 1.16,0.25; 11 1.16,0.75 | smd 0.35 x 0.6: 5 -0.5,-0.91; 6 0,-0.91; 7 0.5,-0.91; 12 0.5,0.91; 13 0,0.91; 14 -0.5,0.91
SOP95P275X110-5N = smd 1.42 x 0.58: 1 -1.145,0.95; 2 -1.145,0; 3 -1.145,-0.95; 4 1.145,-0.95; 5 1.145,0.95
LGA16R50P4X4_330X330X100 = smd 0.61 x 0.32: 1 -1.395,0.75; 2 -1.395,0.25; 3 -1.395,-0.25; 4 -1.395,-0.75; 9 1.395,-0.75; 10 1.395,-0.25; 11 1.395,0.25; 12 1.395,0.75 | smd 0.32 x 0.61: 5 -0.75,-1.395; 6 -0.25,-1.395; 7 0.25,-1.395; 8 0.75,-1.395; 13 0.75,1.395; 14 0.25,1.395; 15 -0.25,1.395; 16 -0.75,1.395
SON50P200X200X80-7N = smd 0.74 x 0.32: 1 -0.985,0.5; 2 -0.985,0; 3 -0.985,-0.5; 4 0.985,-0.5; 5 0.985,0; 6 0.985,0.5 | smd 0.92 x 1.45: 7 0,0
SOIC127P600X175-8N = smd 1.9 x 0.6: 1 -2.455,1.905; 2 -2.455,0.635; 3 -2.455,-0.635; 4 -2.455,-1.905; 5 2.455,-1.905; 6 2.455,-0.635; 7 2.455,0.635; 8 2.455,1.905
AMS-5915 = drill 1 long: 1-GND 7.62,0; 2-VCC 5.08,0; 3-SDA 2.54,0; 4-SCL 0,0
PNEU-BLOCK_V2 = hole 3: -7.5,7.5; -22.5,7.5; 7.5,7.5; -22.5,-7.5; -7.5,-7.5; 7.5,-7.5
DLHR-L30G-E1BD-C-NAV8 = drill 1 pad 1.422 long: 1-GND 0,0; 2-VS 0,-2.54; 3-SDA 0,-5.08; 4-SCL 0,-7.62; 5-EOC 16,-7.62; 6-MISO 16,-5.08; 7-NC 16,-2.54; 8-SS 16,0
4515DO-DS3BK030DPL_NO_SILK = drill 1 pad 1.676 octagon: 1-GND 0,0; 2-VS 0,-2.54; 3-SDA 0,-5.08; 4-SCL 0,-7.62; 5-INT/SS 12.7,-7.62; 6-NC 12.7,-5.08; 7-NC 12.7,-2.54; 8-NC 12.7,0
1X04 = drill 1.016 long: 1 -3.81,0; 2 -1.27,0; 3 1.27,0; 4 3.81,0
1X03 = drill 1.016 long: 1 -2.54,0; 2 0,0; 3 2.54,0

### Placement (x,y rotation side)
12V_IN  3.41,54.22 90 top
C1  30,13.42 0 top
C2  15,13.42 0 top
C3  2.89,28.46 180 top
C4  47.71,54.62 90 top
C5  41.31,53.25 270 top
C6  89.73,56.43 0 top
C7  42.28,32.98 0 top
C8  47.75,35.87 90 top
C9  39.05,36.69 90 top
C10  34.7,35.1 90 top
C11  54.66,25.3 0 top
C12  33.71,38.72 0 top
C13  61.16,30.01 270 top
C14  42.79,24.87 270 top
C15  32.23,25 270 top
C16  13.52,45.37 90 top
C17  8.04,53.7 270 top
C18  15.9,54.41 90 top
C19  21.62,49.83 180 top
C20  21.6,45.34 180 top
C21  27.62,53.57 270 top
C22  35.6,54.65 90 top
C23  93.99,30.11 0 top
C30  71.88,8.88 90 top
C32  24.5,41.3 270 top
C41  16.12,30.93 180 top
C42  16.13,28.52 180 top
C51  48.43,28.26 0 top
C52  48.74,24.82 90 top
C61  27.5,28.37 0 top
C62  27.6,25 90 top
C71  37.87,28.15 0 top
C72  38.25,24.87 90 top
D1  16.12,54.25 0 bottom
D2  26.45,48.84 180 top
D3  31.75,48.87 0 top
ESP_AUD  93.99,26.05 0 top
F1  9.62,53.62 180 bottom
I2C_LINK  53.07,53.58 180 bottom
IC1  71.96,14.77 270 top
IC2_ESP32S2WROOMM22S2  82.56,45.72 270 top
J1_CONN._ADAPTERB.  55.12,48 180 top
J4_USB  65,11.9 0 top
J6_OAT  93,0.1 90 top
J7_I2C  80,4.5 0 top
L1  11.94,53.99 90 top
L2  23.85,54.06 270 top
L3  31.6,53.98 90 top
PS1  19.17,53.12 270 top
R1  35.59,45.7 270 top
R2  32.64,45.72 270 top
R3  37.86,30.32 180 top
R4  27.47,30.57 180 top
R5  48.38,30.5 180 top
R6  23.65,31.4 270 top
R7  31.83,40.88 0 top
R8  38.91,53.22 90 top
R9  21.6,47.55 0 top
R10  88.81,34.86 180 top
R11  15.91,49.37 270 top
R12  18.19,48.82 270 top
R13  16.15,23.65 0 top
R16  70.58,23 90 top
R17  72.62,23 90 top
R18  51,24.75 90 top
R19  30,25 90 top
R20  40.5,24.87 90 top
R21  16.12,26.12 180 top
R22  36.88,35 90 top
R23  38.62,45.71 270 top
R24  43.41,45.83 270 top
SJ2-I2C  57.3,53.6 0 bottom
U1  30,11 0 top
U2  15,11 0 top
U3-IMU  54.66,28.44 270 top
U4  20.51,29.68 270 top
U5  45.73,24.94 270 top
U6  24.75,25 270 top
U7  35.12,25 270 top
U10-MAG_SENSOR  42.93,36.69 0 top
U11  44.64,53.25 180 top
U12  31.82,35.38 270 top
U13-I2C  65.61,28.4 270 top
U$1  3.25,25.25 0 top
U$2  [PNEU-BLOCK_V2]  30,11 0 top
U$3  1.88,31.12 90 top
U$4  10.81,49.5 270 top
UART0  82.22,28.62 270 top
UART1  63.12,41.95 270 top
WIFI_EN  87.5,41.75 90 bottom

### Tracks (layer width: path | path; a pad name or v marks a point on that pad's centre or on a via)
3V3_DIG  (via drill 0.35, 0.4)
  Top 0.254: U11.3 U11.2 | C4.1 47.63,53.75
  Top 0.305: 67.48,31.97 67.48,30.9 U13-I2C.1
  Top 0.508: 67.56,30.9 U13-I2C.1
  Top 0.61: C6.1 88.7,56.35 86.63,56.35 | R1.1 35.57,46.67 R1.1 | v88.13,33.53 88.13,35.12 R10.2 | 47.63,53.75 U11.3 | R24.1 43.3,46.66
  Top 0.813: C6.1 89.06,56.15 IC2_ESP32S2WROOMM22S2.2 | v69.13,30.12 69.13,30.37 67.56,31.94 67.56,30.9
  Top 1: 86.63,56.35 v86.5,56.48 86.49,56.48 51.27,56.48 48.46,53.67 C4.1
  Top 1.016: 35.57,46.67 R2.1 | C13.1 61.17,31.51 62.87,33.21 66.24,33.21 67.48,31.97 | R10.2 87.87,33.82 88.38,33.3 88.38,14.87 | J7_I2C.2 83.19,6.8 86.17,9.77 86.17,12.66 88.38,14.87 | R24.1 44.6,46.78 45.41,47.59 45.41,49.5 46.95,51.03 46.95,52.91 C4.1 | 43.3,46.66 R23.1 R1.1 | J6_OAT.2 93.48,14.44 88.81,14.44 88.38,14.87
  Bottom 1.016: v86.5,56.48 87.5,55.48 WIFI_EN.2 88.61,42.51 89.25,41.87 89.25,34.65 v88.13,33.53 86.95,34.7 79.46,34.7 78.54,33.79 78.54,31.31 78.48,31.31 77.16,29.98 69.26,29.98 v69.13,30.12
5V_EXT  (via drill 0.35)
  Top 1.016: v43.29,48.97 43.29,48.99 33.4,48.99 D3.2
  Bottom 1.016: v43.29,48.97 43.29,48.83 49,43.12 52.54,43.12 J1_CONN._ADAPTERB..1
5VC  (via drill 0.35, 0.4)
  Top 0.254: R6.1 23.8,32.5 24.25,32.5
  Top 0.406: 30.88,32.25 29.76,32.25 | 28.38,33.5 28.38,33.87
  Top 0.508: 29.76,32.25 28.38,33.62 | 27.38,32.5 28.38,33.5
  Top 1.016: R4.1 28.42,32.25 | 28.38,32.5 28.38,33.62 28.38,33.87 28.38,39.38 29.88,40.88 R7.1 30.88,40.92 24.88,40.92 C32.1 | 28.42,32.25 28.42,32.5 28.38,32.5 | 28.42,32.25 30.88,32.25 30.99,32.14 37.87,32.14 38.82,31.19 R3.1 39.06,30.07 43.95,30.07 46.38,32.5 48.65,32.5 49.33,31.82 R5.1 50.75,31.93 57.29,31.93 58.38,33.02 v59.14,33.02 | 28.38,32.5 27.38,32.5 24.25,32.5 | C22.2 35.31,55.75 31.77,55.75 L3.2 31.77,55.41 36.43,55.41 36.88,55.85 v37.5,55.85 35.79,55.85 C22.2
  Bottom 0.254: 59.18,32.99 v59.14,33.02
  Bottom 1.016: v37.5,55.85 31.07,55.85 24.5,49.28 C32.1 | J7_I2C.1 82.55,10.71 79.5,13.76 79.5,22.25 74.28,27.47 65.41,27.47 59.89,32.99 59.18,32.99
5VD  (via drill 0.4)
  Top 0.254: 71.8,7.92 C30.1
  Top 0.305: 65.16,11.69 65.15,11.75
  Top 1: 45.19,38.81 50.19,38.81 53.46,35.54 66.58,35.54 | 71.98,34.9 80.65,24.81 | 77.75,23.5 79.54,23.5 80.86,24.81 UART0.4 | 38.38,50.7 38.92,51.24 R8.1 38.92,51.21 v39.38,50.75 38.63,50.75 38.5,50.62 33.36,50.62 L3.1
  Top 1.016: D2.1 28.01,48.86 D3.1 30.23,51 L3.1 33.28,50.7 38.38,50.7 | 77.75,23.5 v76.25,22 | 45.19,38.81 41.33,42.67 38.78,42.67 38.35,43.11 31.02,43.11 v30.5,43.62 | C30.1 72.45,7.92 72.5,7.87 v73.38,7.87 | 71.8,7.92 70.52,6.64 66.42,6.64 65.16,7.91 65.16,11.69 | 65.15,11.75 J4_USB.1 | 71.98,34.9 67.23,34.9 66.58,35.54 | 80.65,24.81 UART0.4
  Bottom 1: v39.38,50.75 38.63,50.75 37.63,49.75 32.53,49.75 30.5,47.72 v30.5,43.62
  Bottom 1.016: v76.25,22 73.38,22 71.88,20.5 71.88,9.37 v73.38,7.87
D+  (via drill 0.35)
  Top 0.254: IC1.6 72.46,13.06 72.23,12.82 69.81,12.82 69.35,13.28 66.57,13.28 v66.57,13.21
  Bottom 0.254: 65.35,15.9 J4_USB.3
  Bottom 0.406: v66.57,13.21 66.57,14.68 65.35,15.9
D-
  Top 0.254: IC1.5 71.96,13.34 71.91,13.28 70,13.28 69.37,13.92 65.02,13.92 J4_USB.2
ESP_AUD  (via drill 0.35)
  Top 0.61: IC2_ESP32S2WROOMM22S2.39 86.06,32.97 v86.4,32.64
  Bottom 0.61: v86.4,32.64 86.5,32.64 89.15,29.98 89.15,28.59 91.69,26.05 ESP_AUD.1
GND  (via drill 0.35, 0.35 pad 0.6, 0.5)
  Top 0.254: U1.9 U1.8 30.85,12.15 C1.2 | 44.63,54.4 44.63,54.35 | U10-MAG_SENSOR.9 44.83,35.44 44.83,34.01 v44.74,33.92 | 45.64,51.28 45.64,52.73 U11.1 44.68,52.75 44.64,52.71 | 46,36.69 47.4,36.69 | 47.51,36.58 47.65,36.72 | 47.65,36.72 C8.2 | U2.5 16.13,9.57 16.13,9.5 | U2.9 U2.8 15.5,13.07 C2.2 | 29,8.75 29.5,9.25 U1.3 | 55.47,30.16 55.47,29.6 U3-IMU.1 | 48.9,36.72 47.65,36.72 | 90.56,38.86 90.86,38.86 v90.88,38.87 90.56,38.56 90.56,38.5 | 34.71,38.67 C12.2 | 52.78,28.34 53.64,28.34 U3-IMU.6 U3-IMU.7 53.69,28 53.13,28 52.63,28.5
  Top 0.305: 46,36.69 45.75,36.94 U10-MAG_SENSOR.11 | C10.2 34.71,38.67 | v52.39,28.5 52.63,28.5 52.78,28.34
  Top 0.406: IC2_ESP32S2WROOMM22S2.42 90.56,36.59 | U4.2 v20.51,32.49 v20.5,32.5
  Top 0.508: 47.51,36.58 47.4,36.69 | PS1.1 20.95,54.42 | U6.2 v24.75,28.12
  Top 0.61: v21.5,54.97 20.95,54.42 | v35.28,27.71 35.28,27.72 35.13,27.87 U7.2 | U5.2 45.73,27.63 v45.66,27.7 | C61.2 28.45,26.8 C62.2 | U12.2 31.81,37.47 31.1,38.18 30.04,38.18 v29.79,38.43 | 16.13,9.5 16.88,8.75 21.5,8.75 | 21.5,8.75 23.63,8.75 | v21.5,11.5 21.5,8.75 | v23.63,11.5 23.63,8.75 | IC2_ESP32S2WROOMM22S2.26 65.91,38.97 v65.5,39.37 63.16,39.37 UART1.3 | 23.63,8.75 29,8.75 | U$4.1-GND 11.19,49.12 13.38,49.12 13.75,48.75 13.75,46.55 C16.2 | C72.2 38.25,27.58 C71.2
  Top 0.813: U11.7 44.64,54.15 46.02,55.53 | 44.63,54.4 v43.14,55.89 | 44.64,52.71 44.64,52.37 44.58,52.31 | 45.52,51.37 44.64,52.25 44.01,51.62 v42.83,51.62 42.83,51.45 42.3,50.92 41.37,50.92 | v45.52,51.57 45.33,51.77 | C6.2 90.56,56.31 IC2_ESP32S2WROOMM22S2.1 90.56,52.37 86.6,48.41 IC2_ESP32S2WROOMM22S2.51 | IC2_ESP32S2WROOMM22S2.42 90.56,38.5 90.56,38.86 84.13,45.29 84.13,45.35 | IC2_ESP32S2WROOMM22S2.26 74.57,38.97 IC2_ESP32S2WROOMM22S2.47 | v44.44,56.45 44.5,56.51 | 26.35,21.2 28.15,21.2 | C3.2 1.94,31.06 U$3.1-GND
  Top 1: 27.63,56.22 27.5,56.35 v27,56.35 | v28.25,56.35 27.89,56.35 27.62,56.08 | v7.4,56.34 8.03,55.71 8.03,55.1 C17.1 8.01,55.12 8.01,55.72 v8.63,56.35 | 15.9,52.52 C18.1 | 15.4,51.77 15.9,52.27 16.4,51.77 v16.65,51.77 16.41,51.77 15.91,51.27 R11.1 15.91,51.26 15.4,51.77 | 15.4,51.77 v15.15,51.77 | v36.05,52.04 36.02,52.04 35.59,52.47 35.18,52.05 v34.8,52.05 | C22.1 35.6,53.15
  Top 1.016: C11.2 56.83,25.3 v57.39,24.75 | C12.2 37.46,38.72 v37.46,37.67 37.5,37.63 C9.2 | C2.2 22.06,13.41 26.25,17.6 26.25,21.1 26.35,21.2 | C1.2 30.85,14.75 38.5,14.75 40.88,17.12 40.88,20.37 42.8,22.29 C14.2 | 28.15,21.2 28.22,21.12 31.25,21.12 32.24,22.11 C15.2
  Bottom 0.254: v44.74,33.92 44.7,33.92
  Bottom 0.813: v45.52,51.57 | v44.44,56.45 44.64,56.25 44.64,52.15 45.22,51.57 v45.52,51.57
  other vias: 46.03,55.57 46.07,37.03 81.77,48.45 90.65,52.73 81.1,15.75 83.97,46.13 82.5,46.17 81,46.17 81.77,45.37 83.29,46.91 83.27,48.45 84.03,47.66 82.5,47.67 81,47.67 81.76,46.94 83.27,45.37 90.25,30.85 90.23,32.63 83.16,22.68 81.13,17.35 81.36,22.53 21.38,33.22 78.97,29.34 90.3,25.45 81.17,21.15 90.27,29.2 20.1,6.49 25.23,6.51 43.47,17.3 40.38,14.38 19.13,20.36 46.01,21.5 44.59,21.38 74.62,23.5 75.88,23.5 81.53,13.99 72.62,26.25 76.26,32.39 74.5,24.87 86.25,29.87 90.28,22.26 86.3,28.2 86.82,18.03 86.71,20.23 90.28,23.79 62.12,21.17 61.25,20.43 66.31,8.92 78,19.89 77.4,21.05 75.88,20.57 73.4,19.55 74.35,20.63 75.24,8.54 60.74,19.34 63.79,22.98 73.87,16.74 73.97,15.39 73.98,13.88 85.83,14.48 87.38,12 87.38,10.75 87.41,9.34 86.56,7.87 82.88,4.5 22.79,6.41 36.11,7.37 37.31,9.56 1.46,50.14 4.52,43.27 4.48,50.99 6.9,50.94 8.27,51.03 9.54,50.97 11.65,50.91 12.62,50 12.38,48.12 11.88,45.71 9.39,43.5 37.25,52.25 37.25,54.12 28.75,50.62 18.38,56.38 5.88,56.12 5.88,55 53.62,41.75 65.1,52.34 45.22,41.91 52,47.75 60.5,52.12 67.55,14.99 66.4,17.04 49.43,56.41 77.55,43.96 70.25,51.88 78.84,45.12 76.46,42.92 66.62,15.99 75.5,41.77 50.26,45.65 58.36,39.93 60.5,41.38 60.03,39.95 60.5,38.5 60.04,37 49.5,37.38 69,25.5 49.5,34.88 49.5,33.62 50.89,35.97 53.2,33.31 54.81,33.32 78.25,25.37 57.58,34.26 76.5,27.25 69.26,28.67 69.12,32.01 62.09,34.22 73.62,35.16 55.25,52.12 49.5,51.75 44.23,49.66 39.06,39.01 25.88,44.06 26.88,47.38 29.38,47.38 28.25,47.38 29.38,45.5 25.93,45.3 44.97,44.15 23.14,43.73 50.5,52.88 57.63,50.17 63.57,47.05 51.25,51.75 29.73,34.37 29.73,35.75 29.73,37.12 40.5,31.42 41.88,31.42 43.25,31.42 44.75,32.75 60.8,34.22 52.39,34.72 51.64,29.59 56.39,30.67 72.79,28.76 59.33,31.18 60.62,27.37 43.38,28.87 44.75,27.62 44.62,28.87 45.71,30.22 56.75,39.93 39.38,32.75 12.41,30.07 12.38,32.38 19.18,26.04 14.16,21.94 13.6,42.96 12.12,43.02 23.38,28.75 22.12,26.5 13.62,32.38 15.25,32.38 16.75,32.38 1.71,21.44 11.03,29.12 11.05,31.15 5.67,32.61 5.42,29.28 3.14,32.65 9.5,27.34 12.38,28.87 47.15,9.63 45.11,18.94 49.54,13.92 22.88,27.75 19.96,21.02 12.08,18.48 7.07,27.16 10.92,16.01 12.43,20.59 14.86,21.21 13.99,20.36 8.38,38.86 10.62,38.25 10.62,39.5 11.84,46.73 15.25,34.81 15.18,43.01 10.81,45.7 10.77,43 8.85,41.85 6.8,44.94 4.45,44.55 4.67,42.16 4.78,39.76 5.67,34.74 8.28,34.74 10.39,34.87 3.57,33.98 2.25,43.24 2.26,44.66 32.42,17.81 44.6,9.49 18.26,19.48 55.75,21.55 54.05,21.48 36.77,22.13 52.62,21.48 51.04,21.48 49.45,21.5 47.86,21.5 43.42,20.54 42.31,19.5 67.75,21 77.68,12.22 65.12,21 66.73,1.77 61,15.41 66.5,21 68.88,21 67.75,22.25 58.75,13.91 69.12,19 69.73,1.69 60.96,13.79 58.25,19.37 57.38,22.62 58.25,23.62 75.37,6.61 66.51,22.27 62.37,25.26 72.75,31.37 61.66,24.29 68.88,23.5 68.88,22.25 70.25,19.75 70.25,18.5 70.25,17.12 70.25,15.75 73.41,17.99 70.25,11.62 73.5,12.25 74.75,12.25 75.24,9.96 77.88,15.45 77.94,16.91 80.48,11.07 70.25,10.38 70.25,8.88 58.67,12.46 57.86,10.8 57.99,8.64 58.02,6.88 57.98,4.78 60.83,9.15 57.95,1.7 55.09,14.29 54.65,19.01 52.91,19.05 51.24,19.05 49.54,19.06 46.52,19.1 84.62,22.73 86.3,22.23 15.23,36 18.04,36.52 12.88,38.25 19.05,37.26 15.08,46.24 22.47,41.96 12.88,37.12 17.27,40.76 15.13,44.8 17.27,38.35 6.75,43.12 11.62,34.88 12.88,39.5 17.11,35.46 19.11,45.63 22.02,43.72 21.82,40.05 26.75,36.89 26.75,35.68 26.75,33.93 23.2,35.29 22.43,34.3 62.98,15.43 19.9,38.38 20.82,39.25 31.38,30.87 32.62,30.87 34,30.87 35.25,30.87 24.82,33.95 20.72,26.05 34,28.75 31.38,29.75 34,27.75 22.25,23.62 20.63,23.62 19.18,23.68 22.25,25.02 12.53,26.18 17.78,45.64 10.82,21.44 44.31,18.1 17.34,18.64 16.5,17.75 34.34,15.96 5.16,21.47 34.9,20.28 33.38,16.87 34.08,19.43 35.85,21.16 22.03,15.43 48.32,7.32 49.53,8.27 43.32,7.36 46.37,7.32 51,11.72 54.96,11.72 58.29,18.2 48.52,11.06 50.88,9.25 53.25,9.38 55.39,9.39 55.44,17.57 56.74,23.69 55.35,23.75 57.15,30.25 68.13,33.38 60.89,23.3 93.23,16.07 77.47,34.63 91.35,16.07 92,7.62 89.75,16.62 95.62,14.25 90.26,20.35 94.38,7.62 81.12,19.38 83.77,2.88 79.74,2.89 82.01,2.84 77.6,4.5 80.95,4.39 84.41,10.44 86.82,16.03 77.99,18.36 76.1,12.15 71.53,5.88 68.41,1.73 63.47,1.78 65.13,1.81 66.32,10.61 62.62,7.75 68.75,7.75 67.25,7.75 62.62,5.38 61.51,1.81 59.76,1.75 68.75,5.38 67.12,5.38 65.5,5.38 40.73,7.34 41.95,9.56 52.91,11.74 49.38,17.37 28.88,19 12.38,27.75 39.14,13.58 64.76,37.03 65.5,40.75 58.67,37 57.29,37 55.92,37 54.54,37 53.43,38.13 55.12,39.97 52.41,39.27 39,56.25 40.38,56.25 41.75,56.25 36.8,41.88 29.38,42.75 29.38,44.12 26.54,42.17 25.88,46.5 64.62,48.12 54.02,49.84 9.61,40.62 3.52,40.51 2.48,41.58 4.49,38.63 3.53,35.29 27.93,42.24 35.29,41.86 19.12,43.84 20.45,43.81 12.88,40.75 12.88,34.88 12.88,36 62.93,13.76 52.5,51.75 55.67,48.09 50.18,41.66 53.15,50.71 56.12,51.38 53.67,40 49.23,44.95 51.54,33.23 46,33.88 70.38,45.75 71.5,44.62 71.5,43.25 71.5,41.75 71.44,39.88 45.74,28.87 52.62,23.78 49.5,12.35 37.04,13.6 35.25,29.8 35.25,28.75 37.5,39 36.25,39 36.17,37.67 40.68,50.73 40.2,44.67 58.12,43.38 60.39,45.58 21.5,53.85 52.38,27.25 39.72,22.14 41.12,34.75 39.59,20.76 31.5,17.03 3.22,21.54 12.94,19.4 11.03,17.28 7.05,21.48 8.71,21.9 16.48,45.98 15.61,21.96 12.38,31.25 17.27,42.96 15.08,38.38 15.01,40.73 19.69,40.7 45.06,45.18 74.58,40.77 57.38,26.12 58.5,28.37 20.69,14.74 42.27,15.99 47.95,19.08 38.44,7.38 39.66,9.64 61.01,16.74 73.5,10.75 89.62,52.75 90.88,40.62 90.88,42.62 89.12,44 89.12,47.12 89.12,50.12 63,16.91 84.88,39.88 68.72,15.04 86,47.12 86,50.25 73.38,39.75 76.88,39.88 79.25,39.88 82.25,39.88 70.38,50.25 70.38,47.62 72.45,51.84 74.88,51.75 77.75,51.62 80.88,51.62 84,51.62 90.75,45.38 90.62,48.62 90.62,51.38 60.38,44.38 31.63,50.63 32.62,29.75 34,29.8 49.5,15.62 84.87,12.88 82.98,12.83 45,35 38.5,33.5 90.38,18.16 44.64,53.26 77.87,14.02 86.25,24.5 86.25,26.49 74.9,33.84 86.32,31.24 62.94,22.1 37.04,47.84 52.35,44.59
  pour Bottom (isolate 0.254): 0,0 100,0 100,31.75 92,31.75 92,58 0,58
  pour Top (isolate 0.2): 0,58 92,58 92,31.75 99.88,31.75 99.88,0 0.25,0 0,-0.25
IO
  Top 0.254: 63.63,9.95 63.74,10.06 63.74,20.99 65.83,23.09 67.84,23.09 68.16,23.41 68.16,28.53 68.11,28.53 66.81,29.83 66.81,30.3 U13-I2C.2
  Top 0.61: J6_OAT.3 86.81,1.59 72.55,1.6 70.4,3.75 63.63,3.75 63.63,9.95
N$2
  Top 0.254: 45.03,36.43 44.34,36.43 U10-MAG_SENSOR.10 | C8.1 47.52,35.15
  Top 0.305: 45.03,36.43 46.3,35.15
  Top 0.813: 47.52,35.15 46.3,35.15
N$7
  Top 0.508: IC2_ESP32S2WROOMM22S2.41 89.06,36.56 89.53,36.1 R10.1
  Top 0.61: C23.1 92.06,30.11 91.3,30.88 91.3,33.71 90.14,34.86 R10.1
N$9  (via drill 0.35)
  Top 1.016: L1.1 11.86,52.31 C17.2
  Top 1.27: v13.63,51 12.24,52.39 L1.1
  Bottom 1.27: D1.C 18.15,50.52 17.38,49.75 14.88,49.75 v13.63,51
N$13
  Top 0.406: PS1.3 18.22,53.38 19.17,52.43 PS1.5
  Top 0.61: PS1.3 18.22,54.78 17.2,55.8 C18.2
  Top 1.016: L1.2 12.03,55.67 15.78,55.67 C18.2
N$16
  Top 0.813: 20.65,47.16 20.07,47.74 18.32,47.74 R12.2
  Top 1: R12.2 16.46,47.87 R11.2
  Top 1.016: 20.65,47.16 C20.2 R9.1
N$17
  Top 0.61: L2.1 23.48,56.03 19.73,56.03 19.17,55.47 PS1.2 19.17,53.73 19.7,53.2 20.5,53.2 21.3,52.4 21.3,51.8 22.57,50.53 C19.1
N$18
  Top 0.61: PS1.4 18.22,50.26 R12.1
N$20
  Top 0.61: PS1.6 20.12,50.38 C19.2
N$24
  Bottom 1.27: 12V_IN.1 6.89,52.94 F1.1
N$25  (via drill 0.35)
  Top 0.508: IC2_ESP32S2WROOMM22S2.40 87.5,37.03 v87.5,39
  Bottom 0.508: 87.32,40.75 WIFI_EN.1
  Bottom 0.813: v87.5,39 87.5,40.75 87.32,40.75
N$27
  Top 0.305: R17.1 72.63,21.92 72,21.3 72,17.77 72.57,17.2 72.57,15.58 IC1.1
N$28
  Top 0.305: R16.1 71.36,21.27 71.36,17.51 71.96,16.91 IC1.2
N$32
  Bottom 1.27: F1.2 12.19,54.12 13.98,54.12 D1.A
N$33
  Top 0.305: 24.52,52.45 24.93,52.04 | 24.48,52.45 24.73,52.2 | D2.2 24.93,48.55
  Top 0.813: 24.52,52.45 L2.2 | R9.2 23.93,47.55 24.93,48.55
  Top 1.016: R9.2 C20.1 | L2.2 24.48,52.45 | 24.73,52.2 27.6,52.2 C21.2 | 24.93,52.04 D2.2
SCL0  (via drill 0.35)
  Top 0.254: U3-IMU.13 56.67,28.44 57.22,27.89 | 12.88,10.75 U2.2 | 28.17,10.76 28.18,10.75 U1.2
  Top 0.305: U10-MAG_SENSOR.1 40.75,38.22 | 57,20.2 57.04,20.24
  Top 0.508: 40.75,38.22 40.75,39.62 39.59,40.79 v39.59,40.95
  Top 0.61: v46.46,41.31 46.83,41.68 47.81,41.68 59.55,53.43 60.57,53.43 v60.5,53.5 60.67,53.67 65.45,53.67 66.66,52.47 IC2_ESP32S2WROOMM22S2.17 | v50,20.24 57.04,20.24 59.41,22.61 59.41,24.54 | U13-I2C.4 63.71,28.84 59.41,24.54 | 59.41,24.54 59.41,25.7 57.22,27.89 | 28.17,10.76 27.79,11.13 v27.79,20.11 | 12.88,10.75 12.12,11.5 12.12,17.04 v16.72,21.63 | v56.57,16.41 57,16.83 57,20.2 | R2.2 33.36,44.76 33.55,44.57 v33.97,44.57
  Bottom 0.305: 9.48,39.39 9.48,31.14
  Bottom 0.406: U$4.4-SCL 3.15,49.45 3.15,42.16 4.62,40.69 8.19,40.69 9.48,39.39 | U$3.4-SCL 9.48,31.14
  Bottom 0.508: v56.57,16.41 56.57,4.31 58.05,2.83 70.06,2.83 71.55,1.34 76.24,1.34 79.49,4.59 J7_I2C.4 | v39.59,40.95 39.36,40.73 35.88,40.73
  Bottom 0.61: SJ2-I2C.1 59.96,53.6 60.5,53.54 v60.5,53.5 | v50,20.24 49.96,20.2 44.71,20.2 40.13,15.61 36.17,15.61 31.67,20.11 v27.79,20.11 27.79,19.86 25.43,19.86 23.34,21.95 17.04,21.95 v16.72,21.63 16.97,21.89 18.24,21.89 18.24,32.99 17.57,33.66 17.58,33.67 17.13,33.67 | 35.88,40.73 33.97,40.73 | 33.97,40.73 29.25,40.73 27.57,39.04 22.51,39.04 17.13,33.67 | v46.46,41.31 46.15,41 39.63,41 v39.59,40.95 | 17.13,33.67 12.04,33.67 U$3.4-SCL 9.5,29.83 7.93,28.26 5.24,28.26 3.25,26.28 U$1.4-SCL | 33.97,40.73 v33.97,44.57
SCL1  (via drill 0.35)
  Top 0.61: IC2_ESP32S2WROOMM22S2.19 64.41,49.47 v64.38,49.5 62.88,51 60.16,51 55.64,46.47 J1_CONN._ADAPTERB..4 | v41.23,45.14 41.32,45.14 41.46,45 43.3,45 R24.2
  Bottom 0.61: SJ2-I2C.2 56.54,52.72 58.26,51 62.52,51 64.02,49.5 v64.38,49.5 | J1_CONN._ADAPTERB..4 55.64,45.94 50.93,50.64 42.16,50.64 41.23,49.7 v41.23,45.14
SDA0  (via drill 0.35)
  Top 0.254: U3-IMU.14 55.82,28.94 56.19,29.32 | 15,9 U2.4 | 30,7.46 U1.4
  Top 0.305: U10-MAG_SENSOR.16 42.18,39.46 41.58,40.05 v41.51,40.05 | 5.7,39.05 6.99,37.76 6.99,31.41 6.95,31.37 | U$3.3-SDA 6.96,32.24
  Top 0.406: U$4.3-SDA 5.7,49.46 5.7,39.05 | 6.95,31.37 U$3.3-SDA | 56.19,29.32 58.74,29.32 v59.11,29.69 | v52.63,55.25 52.63,55.3
  Top 0.508: v19.98,33.58 19.94,33.62 8.33,33.62 6.96,32.24 | 31.63,7.46 30,7.46 | 15,7.46 15,9
  Top 0.61: IC2_ESP32S2WROOMM22S2.16 67.24,55.29 61.51,55.29 61.5,55.3 52.63,55.3 51.55,55.3 48.5,52.25 48.5,50.75 46.52,48.77 v46.52,43.17 | U13-I2C.5 63.71,24.21 59.75,20.25 v59.75,19.86 59.75,17.37 57.63,15.25 57.63,12.37 55.88,10.62 50,10.62 47.88,8.5 47.88,8.46 32.63,8.46 31.63,7.46 15,7.46 | U$1.3-SDA 5.79,28.25 6.46,28.92 6.46,30.64 U$3.3-SDA | v36.94,44.69 36.88,44.75 R1.2
  Bottom 0.254: 47.38,40.78 47.38,41.37 47.48,41.37 47.5,41.37
  Bottom 0.305: 59.77,19.84 v59.75,19.86
  Bottom 0.508: v41.51,40.05 41.51,39.95 40.66,39.95 29.82,39.94 27.94,38.05 23.56,38.05 19.98,34.5 v19.98,33.58 | J7_I2C.3 79.64,10.59 76.84,10.59 76.28,10.02 76.28,3.28 75.23,2.23 73.02,2.23 71,4.25 60.66,4.25 59.75,5.16 v59.75,19.86 | v36.94,44.69 36.94,43.6 37.67,42.87
  Bottom 0.61: v52.63,55.25 52.31,54.94 I2C_LINK.1 | v59.75,19.86 59.62,19.99 59.62,29.18 v59.11,29.69 58.74,30.06 58.66,30.06 58.19,30.54 58.19,31.56 55.03,34.72 54.09,34.72 47.61,41.2 47.61,41.24 47.48,41.37 47.48,41.94 46.54,42.87 46.52,42.87 | v41.51,40.05 41.58,40.12 46.72,40.12 47.38,40.78 | v46.52,43.17 46.52,42.87 | 46.52,42.87 37.67,42.87
SDA1  (via drill 0.35)
  Top 0.61: IC2_ESP32S2WROOMM22S2.18 67.28,51 64.8,51 63.53,52.27 v63.53,52.29 | R23.2 39.62,43.76 41.69,43.76 45.57,39.87 51.13,39.87 v52,40.75
  Bottom 0.406: J1_CONN._ADAPTERB..3 54.62,40.84 52.05,40.84 52,40.79 v52,40.75 52.13,40.87 58,40.87 59.25,42.12 59.25,46.79 53.84,52.2 I2C_LINK.2
  Bottom 0.61: I2C_LINK.2 53.84,54.08 55.51,55.76 60.99,55.76 63.53,53.22 v63.53,52.29
U0RXD
  Top 0.61: 83.34,29.89 84.67,31.23 84.67,37.02 84.62,36.97 IC2_ESP32S2WROOMM22S2.38
  Top 0.813: UART0.2 83.34,29.89
U0TXD
  Top 0.61: IC2_ESP32S2WROOMM22S2.37 83.06,36.02 82.24,35.2 82.24,32.45
  Top 0.813: UART0.1 82.24,32.45
U1RXD
  Top 0.508: IC2_ESP32S2WROOMM22S2.21 66.37,46.47 65.63,45.72 65.63,43.12 64.45,41.95 UART1.2
U1TXD
  Top 0.508: IC2_ESP32S2WROOMM22S2.20 66.17,47.97 63.1,44.9 63.1,44.49 UART1.1
USB_D+  (via drill 0.35)
  Top 0.508: v70.5,32.04 70.63,32.17 70.63,24 R16.2
  Top 0.61: IC2_ESP32S2WROOMM22S2.23 67.34,43.5 v68.75,43.5
  Bottom 0.508: v68.75,43.5 69.25,43 69.25,33.29 v70.5,32.04
USB_D-  (via drill 0.35)
  Top 0.508: v71.63,32.05 71.63,25.2 72.63,24.2 R17.2
  Top 0.61: IC2_ESP32S2WROOMM22S2.22 68.72,44.97 v68.75,45
  Bottom 0.508: v68.75,45 69,45 70.13,43.87 70.13,41.01 70.12,41 70.12,33.82 71.63,32.32 v71.63,32.05
VDD1
  Top 0.254: U7.5
  Top 0.61: C72.1 38.19,23.86 U7.5
  Top 1.27: C72.1 R20.1
VDD1F  (via drill 0.35, 0.4)
  Top 0.254: C1.1 29.15,12.15 U1.10 29.5,11.55 U1.1 29.63,11.25 30.13,10.75 U1.6 30.5,10.45 U1.5
  Top 1.016: C1.1 29.15,16.35 33.12,20.42 v34.38,21.67 | v42,28.25 42.8,27.45 C14.1
  Top 1.27: C14.1 R20.2
  Bottom 1.016: v34.38,21.67 40.95,28.25 v42,28.25
VDD1P
  Top 0.305: C71.1 36.92,27.76 36.58,27.42
  Top 0.406: U7.1 36.08,25.45 35.5,24.87 34.75,24.87 34.13,25.5 34.13,26.09 U7.3 | C71.1
  Top 0.61: U7.1 36.08,26.91 36.58,27.42
  Top 1.016: C71.1 R3.2
VDD2
  Top 0.61: U6.5 27.41,23.85 C62.1
  Top 1.016: C62.1 R19.1
VDD2F  (via drill 0.35, 0.4)
  Top 0.254: U2.6 15.25,10.75 14.75,11.25 U2.1 14.5,11.55 U2.10 14.15,12.15 C2.1
  Top 1.016: C2.1 14.15,17.42 19.16,22.42 v29.5,22.42 | R19.2 C15.1 32.24,28.2 v31.84,28.59
  Bottom 1.016: v29.5,22.42 32,24.92 32,28.44 v31.84,28.59
VDD2P
  Top 0.406: U6.1 25.7,25.45 25.13,24.87 24.38,24.87 23.75,25.5 23.75,26.09 U6.3
  Top 0.508: C61.1 26.36,28.57 26.36,28.79
  Top 0.61: U6.1 25.7,27.09 26.36,27.75 26.36,28.79
  Top 1.016: R4.2 26.52,28.4 C61.1
VDD3
  Top 0.508: U5.5 48.67,23.79
  Top 0.61: 48.67,23.79 C52.1
  Top 1.016: C52.1 51.07,23.86 R18.1
VDD3F
  Top 0.254: U3-IMU.8 53.91,26.5 55.75,26.5 56.25,27 56.25,27.56 55.82,27.99 55.61,27.99 U3-IMU.12 54.97,27.94 54.85,28.06 54.85,28.58 54.49,28.94 U3-IMU.5
  Top 0.305: 53.91,26.5 53.91,25.5
  Top 0.406: 53.91,25.5 C11.1
  Top 1.016: C11.1 53.6,25.19 53.55,25.19 53,25.75 51.05,25.75 R18.2
VDD3P
  Top 0.406: U5.1 46.68,25.43 46.13,24.87 45.27,24.87 44.75,25.39 44.75,26.05 U5.3
  Top 0.61: U5.1 46.68,26.8 47.5,27.62 47.5,28.24 C51.1
  Top 1.016: R5.2 47.43,28.32 47.5,28.24
VDD4
  Top 0.406: C42.1 18.73,26.87 20.75,26.87 21.5,27.62 21.5,28.48
  Top 0.61: C42.1 R21.1 17.08,23.67 R13.2 | 21.5,28.48 U4.5
VDD4F  (via drill 0.35, 0.4)
  Top 0.254: v12.57,22.1
  Top 0.406: U$4.2-VS 8.23,49.46 8.23,44.87 8.57,44.53 | 8.21,43.44 8.23,43.42 | C16.1 12.76,44.42 12.65,44.53
  Top 0.61: 8.23,44.87 8.23,43.42 | 8.21,43.44 8.21,43.06 7.14,41.99 v7.14,39.29 | 12.65,44.53 8.57,44.53 | R21.2 14.15,26.12 13.02,25 13.02,22.56 v12.57,22.1
  Top 0.813: C3.1 3.84,30.55 U$3.2-VS
  Bottom 0.305: 4.4,31.14 4.4,37.27 6.42,39.29
  Bottom 0.406: U$3.2-VS 4.4,31.14 | 6.42,39.29 v7.14,39.29
  Bottom 0.61: 8.33,24.25 9.99,22.59 11.03,22.59 11.52,22.1 v12.57,22.1 | U$3.2-VS 4.42,30.14 1.75,27.47 1.75,22.49 6.57,22.49 8.33,24.25 | 8.33,24.25 U$1.2-VCC
VDD4P
  Top 0.406: R6.2 21.82,30.45 U4.1 21.46,30.08 21.02,29.65 21,29.65 20.99,29.64 20.02,29.64 20.01,29.65 19.98,29.65 19.56,30.07 U4.3 17.17,30.82 C41.1
VDD5
  Top 0.61: U12.5 34.63,34.23 C10.1
  Top 1.016: R22.1 34.81,34.05 C10.1
VDD5F
  Top 0.254: 41.47,32.84 C7.1
  Top 0.305: U10-MAG_SENSOR.4 40.63,35.94 | 40.63,35.94 39.26,35.94 C9.1 | 40.63,35.94 40.63,36.75 40.82,36.94 U10-MAG_SENSOR.2 42.93,36.94 43.68,37.69 U10-MAG_SENSOR.13
  Top 1.016: 41.47,32.84 41.03,32.84 39.05,34.82 C9.1 38.93,35.86 36.97,35.86 R22.2
VDD5P
  Top 0.406: U12.1 32.77,35.76 32.34,35.34 31.29,35.34 30.87,35.76 U12.3
  Top 0.61: U12.1 C12.1
  Top 1.016: C12.1 32.76,40.08 R7.2
VDD_DIGP
  Top 0.254: U11.4 42.8,53.75 | 42.8,53.75 42.34,54.21 C5.1 | U11.6 42.91,52.75 42.8,52.86 42.8,53.75
  Top 1: R8.2 38.96,54.21 C5.1

### Text on the board
tNames: GND-TX-RX | TX-RX-GND-5V | AMS-5915
bNames: DM/dD | 12V-GND